# EAGLE design ir-blaster (EAGLE 7.5.0)
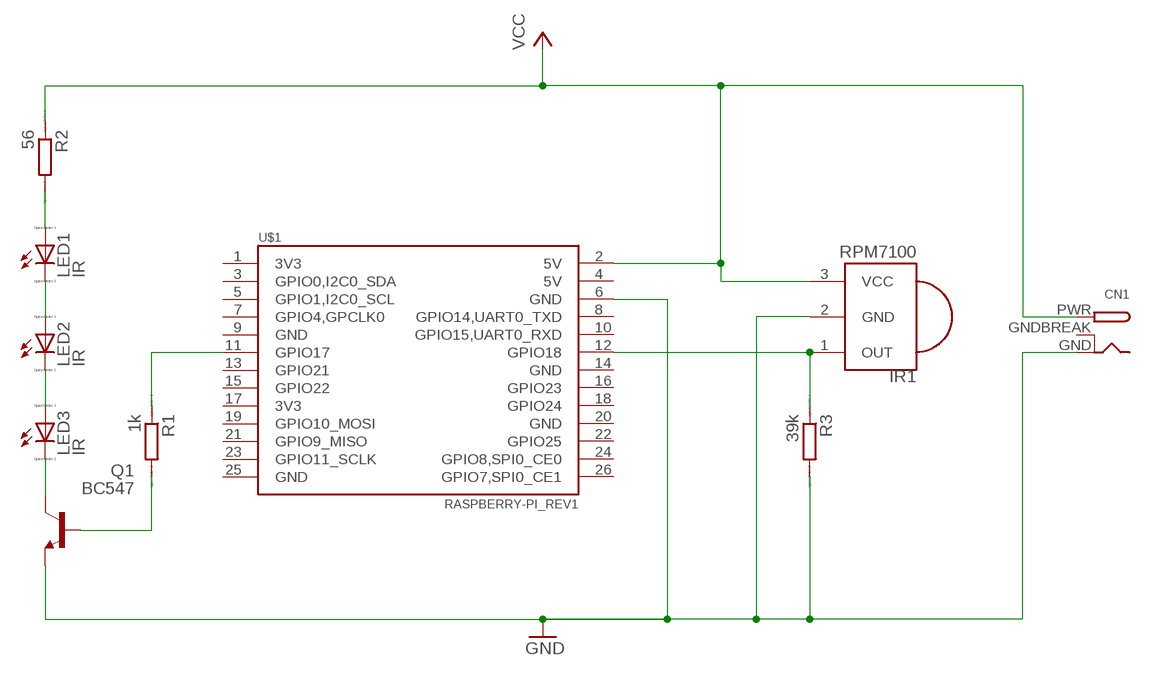
[diagram p0: schematic, sheet 1]

## Parts
CN1  DCBARRELPTH  [DCJACK_2MM_PTH]
IR1  RPM7100  PNA460XM  [PNA460XM]
LED1  IR  LED_ELD260  [LED_LD260]
LED2  IR  LED_ELD260  [LED_LD260]
LED3  IR  LED_ELD260  [LED_LD260]
Q1  BC547  [TO92]
R1  1k  R0207/10  [0207/10]
R2  56  R0207/10  [0207/10]
R3  39k  R0207/10  [0207/10]
U$1  RASPBERRY-PI_REV1  [RASPBERRY-PI_REV1]

## Nets
GND: CN1.GND IR1.2(GND) Q1.1(E) R3.2 U$1.6(GND)
N$1: LED3.K(C) Q1.3(C)
N$2: LED1.A R2.2
N$3: LED1.K(C) LED2.A
N$4: LED2.K(C) LED3.A
N$5: Q1.2(B) R1.2
N$6: R1.1 U$1.11(GPIO17)
N$7: IR1.1(OUT) R3.1 U$1.12(GPIO18)
VCC: CN1.PWR IR1.3(VCC) R2.1 U$1.2(5V)
Unconnected: U$1.1(3V3) U$1.3(GPIO0,I2C0_SDA) U$1.4(5V) U$1.5(GPIO1,I2C0_SCL) U$1.7(GPIO4,GPCLK0) U$1.8(GPIO14,UART0_TXD) U$1.9(GND) U$1.10(GPIO15,UART0_RXD) U$1.13(GPIO21) U$1.14(GND) U$1.15(GPIO22) U$1.16(GPIO23) U$1.17(3V3) U$1.18(GPIO24) U$1.19(GPIO10_MOSI) U$1.20(GND) U$1.21(GPIO9_MISO) U$1.22(GPIO25) U$1.23(GPIO11_SCLK) U$1.24(GPIO8,SPI0_CE0) U$1.25(GND) U$1.26(GPIO7,SPI0_CE1)

## Power pins joined to a net without a drawn wire
GNDBREAK: CN1.GNDBREAK

## Library data of the parts
CN1 = adafruit:DCBARREL: 2.0mm DC Barrel Jack DCJACK_2MM_PTH - Through Hole Jack (4UConnector: 05537)
IR1 = adafruit:PNA460XM: IR 38KHz receiver PNA4602 and related receivers http://www.ladyada.net/library/pcb/eaglelibrary.html
LED1-LED3 = eagle-ltspice:LED_E: LED Source: http://www.osram.convergy.de Source: www.luxeon.com Source: www.kingbright.com; SPICEMODEL: NONE; SPICEPREFIX: D; SPICETYPE: diode
Q1 = transistor:BC547: NPN TRANSISTOR
R1-R3 = eagle-ltspice:R: RESISTOR, European symbol; SPICEMODEL: NONE; SPICEPREFIX: R
U$1 = RaspberryPi:RASPBERRY-PI_REV1: Raspberry Pi Board <http://www.raspberrypi.org/> Jacques Lagnel V1.0 (beta) 2012 Mateusz Bawaj V1.1 (beta) 2012 Board dimension: Forum 3D model <http://www.raspberrypi.org/forum/general-discussion/mechanical-profile-3d-models?value=3d%20model&type=1&include=1&search=1&ret=all> The GPIO Connector (P1): http://elinux.org/RPi_Low-level_peripherals

## Board
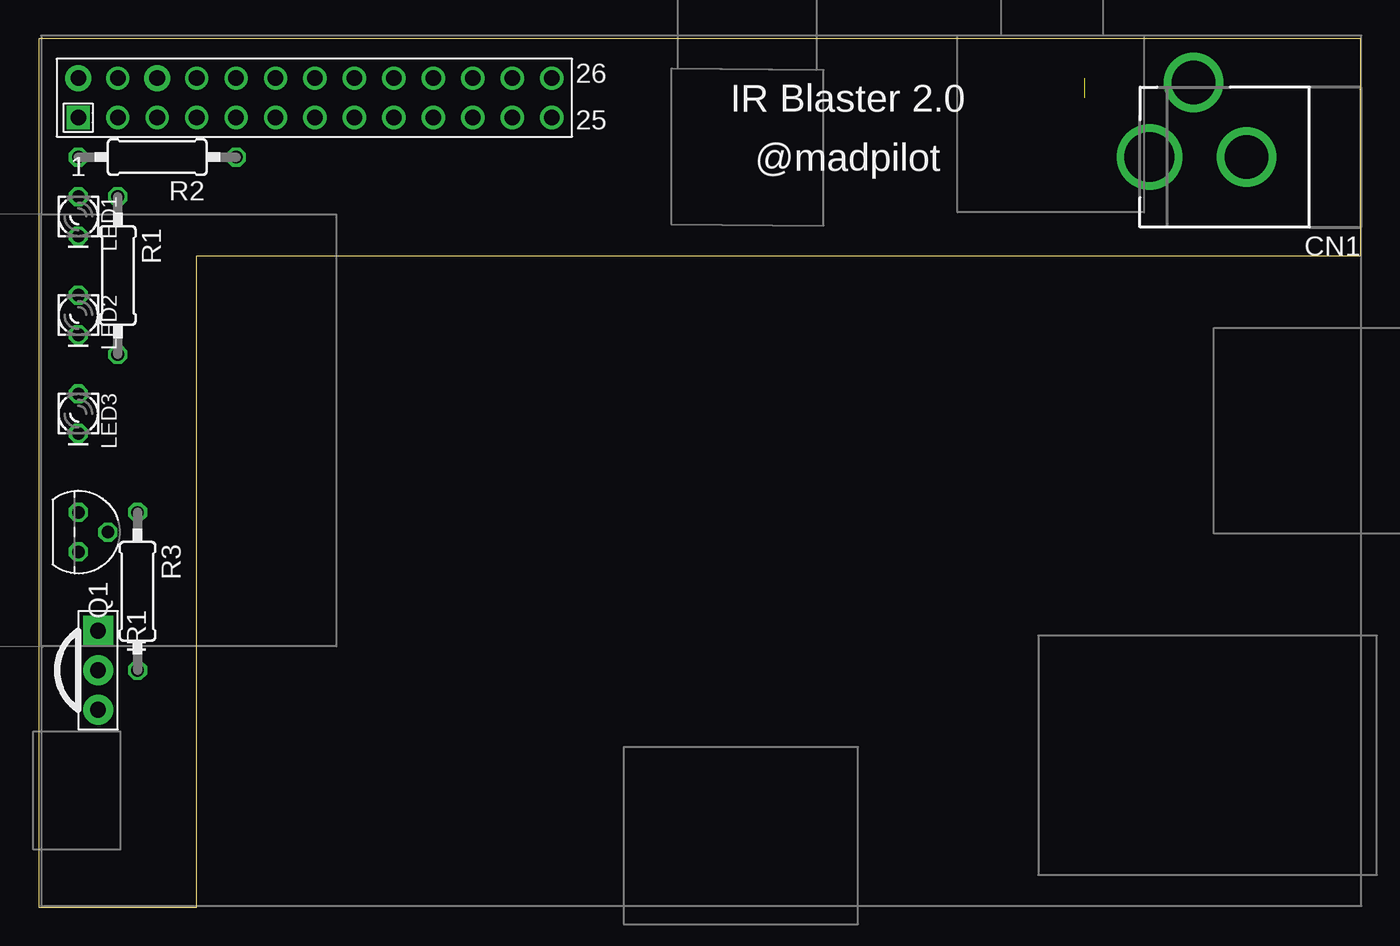
[diagram p1: board, top side]
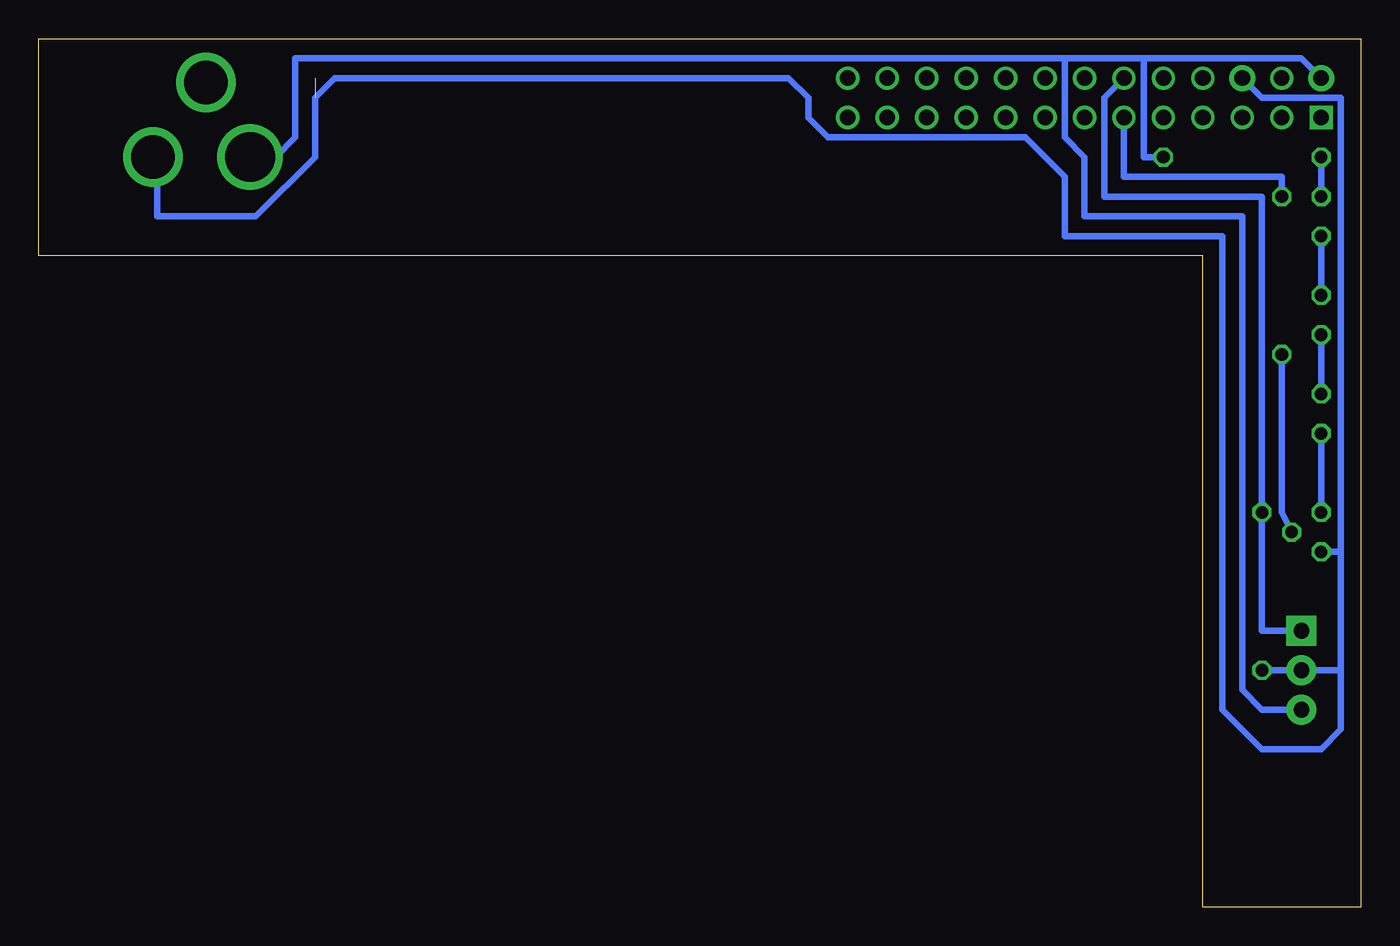
[diagram p2: board, bottom side, seen from below]

Size 85.09 x 55.87 mm. Coordinates in mm from the lower left corner, seen from the top.
Outline: 0,0 10.16,0 10.16,41.91 85.09,41.91 85.09,55.87 0,55.87 0,0
Copper layers (1*16): Top 0.0356mm / dielectric 1.5011mm / Bottom 0.0356mm
Design rules "LaenPCBOrder": minimum track width 6mil, minimum drill 13mil, track to track 6mil, track to pad 6mil, pad to pad 6mil, via to via 6mil, smd to smd 6mil, copper to edge 15mil, drill to drill 6mil, minimum pad ring 7mil, minimum via ring 7mil, stop-mask expansion 3mil, vias tented up to drill 0mil, thermal gap 10mil

### Footprints (pad centres in the part's own frame; a part is rotated, then mirrored left to right if it is on the bottom)
DCJACK_2MM_PTH = drill 2.8: GND 0,7.35; GNDBREAK 4.8,10.75 | drill 3.2: PWR 0,13.6
PNA460XM = drill 1.016 pad 1.93 square: 1 -2.54,0 | drill 1.016 pad 1.93: 2 0,0; 3 2.54,0
LED_LD260 = drill 0.813 octagon: A -1.27,0; K 1.27,0
TO92 = drill 0.813 octagon: 1 1.27,0; 2 0,1.905; 3 -1.27,0
0207/10 = drill 0.813 octagon: 1 -5.08,0; 2 5.08,0
RASPBERRY-PI_REV1 = drill 1 square: 1 -41.91,21.59 | drill 1 pad 1.676: 2 -41.91,24.13; 6 -36.83,24.13 | drill 1: 3 -39.37,21.59; 4 -39.37,24.13; 5 -36.83,21.59; 7 -34.29,21.59; 8 -34.29,24.13; 9 -31.75,21.59; 10 -31.75,24.13; 11 -29.21,21.59; 12 -29.21,24.13; 13 -26.67,21.59; 14 -26.67,24.13; 15 -24.13,21.59; 16 -24.13,24.13; 17 -21.59,21.59; 18 -21.59,24.13; 19 -19.05,21.59; 20 -19.05,24.13; 21 -16.51,21.59; 22 -16.51,24.13; 23 -13.97,21.59; 24 -13.97,24.13; 25 -11.43,21.59; 26 -11.43,24.13

### Placement (x,y rotation side)
CN1  85.09,48.26 90 top
IR1  3.81,15.24 270 top
LED1  2.54,44.45 270 top
LED2  2.54,38.1 270 top
LED3  2.54,31.75 270 top
Q1  2.54,24.13 270 top
R1  5.08,40.64 270 top
R2  7.62,48.26 180 top
R3  6.35,20.32 270 top
U$1  44.45,29.21 0 top

### Tracks (layer width: path | path; a pad name or v marks a point on that pad's centre or on a via)
GND  (1 unrouted)
  Bottom 0.406: 1.27,15.24 IR1.2 R3.2 | 1.27,22.86 1.27,52.07 6.35,52.07 U$1.6 | 1.27,22.86 1.27,15.24 | CN1.GND 77.47,48.26 77.47,44.45 71.12,44.45 67.31,48.26 67.31,52.07 66.04,53.34 36.83,53.34 35.56,52.07 35.56,50.8 34.29,49.53 21.59,49.53 19.05,46.99 19.05,43.18 8.89,43.18 8.89,12.7 6.35,10.16 2.54,10.16 1.27,11.43 1.27,15.24 | Q1.1 1.27,22.86
N$1
  Bottom 0.406: LED3.K Q1.3
N$2
  Bottom 0.406: R2.2 LED1.A
N$3
  Bottom 0.406: LED1.K LED2.A
N$4
  Bottom 0.406: LED2.K LED3.A
N$5
  Bottom 0.406: Q1.2 5.08,25.4 R1.2
N$6
  Bottom 0.406: R1.1 5.08,46.99 15.24,46.99 U$1.11
N$7
  Bottom 0.406: IR1.1 6.35,17.78 R3.1 6.35,45.72 16.51,45.72 16.51,52.07 U$1.12
VCC
  Bottom 0.406: CN1.PWR 69.85,48.26 68.58,49.53 68.58,54.61 19.05,54.61 | 19.05,54.61 13.97,54.61 | R2.1 13.97,48.26 13.97,54.61 | IR1.3 6.35,12.7 7.62,13.97 7.62,44.45 17.78,44.45 17.78,48.26 19.05,49.53 19.05,54.61 | U$1.2 3.81,54.61 13.97,54.61

### Text on the board
tPlace: IR Blaster 2.0 | @madpilot